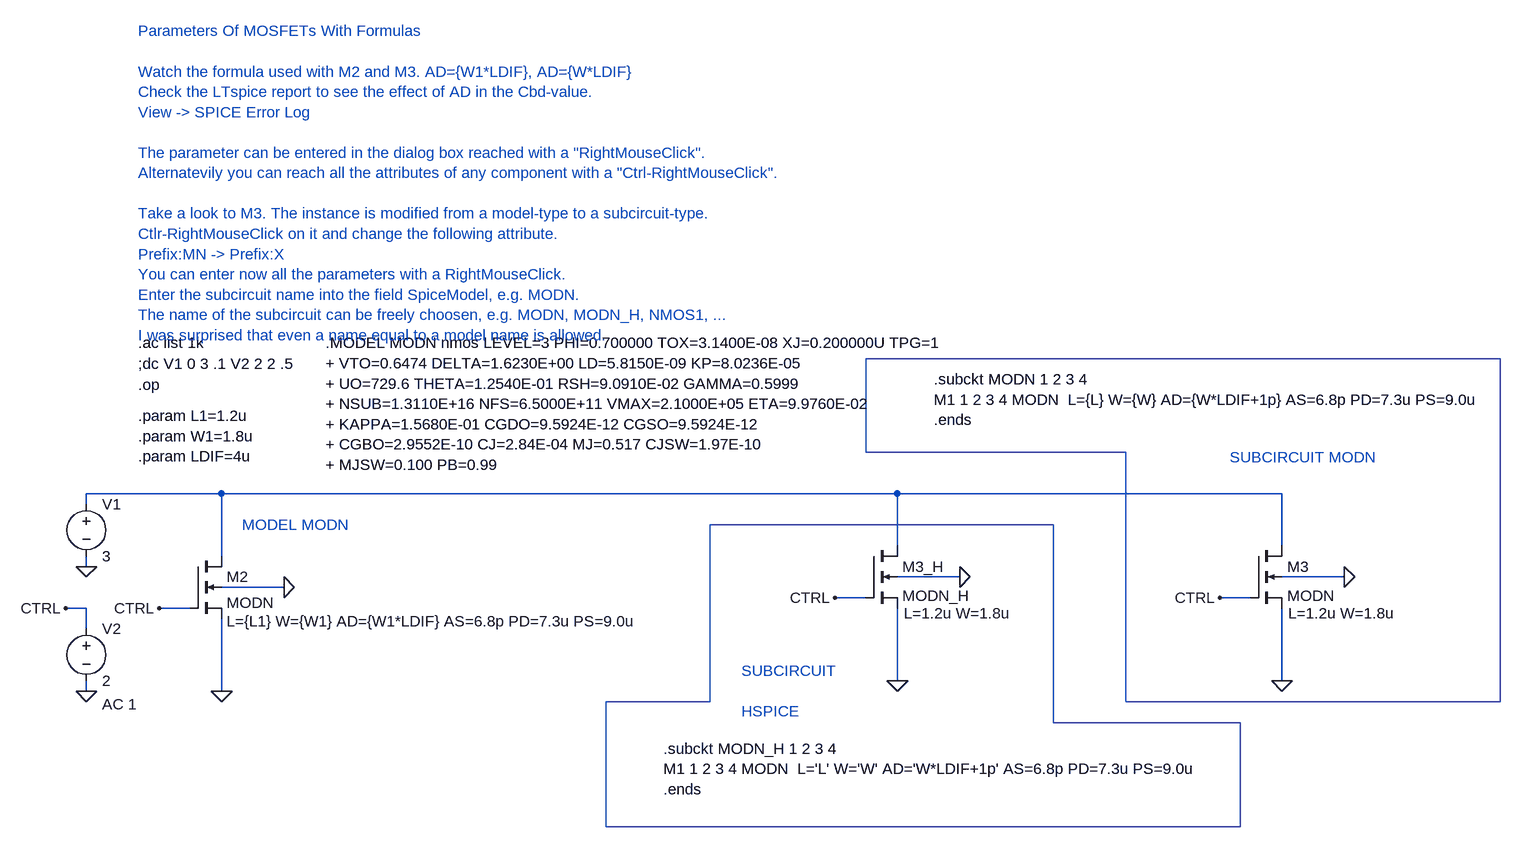
[diagram p0: schematic Mosfet_param_line_hspice.asc]
Mosfet_param_line_hspice.asc, the LTspice schematic file:
Version 4
SHEET 1 2056 680
WIRE -144 112 -352 112
WIRE 896 112 -144 112
WIRE 1488 112 896 112
WIRE -352 128 -352 112
WIRE 896 192 896 112
WIRE 1488 192 1488 112
WIRE -144 208 -144 112
WIRE -352 224 -352 208
WIRE 992 240 896 240
WIRE 1584 240 1488 240
WIRE -48 256 -144 256
WIRE 848 272 800 272
WIRE 1440 272 1392 272
WIRE -352 288 -384 288
WIRE -192 288 -240 288
WIRE -352 320 -352 288
WIRE 896 400 896 288
WIRE 1488 400 1488 288
WIRE -352 416 -352 400
WIRE -144 416 -144 304
FLAG -48 256 0
FLAG -144 416 0
FLAG -240 288 CTRL
FLAG 1584 240 0
FLAG 1488 400 0
FLAG 1392 272 CTRL
FLAG 992 240 0
FLAG 896 400 0
FLAG 800 272 CTRL
FLAG -352 224 0
FLAG -384 288 CTRL
FLAG -352 416 0
SYMBOL nmos4 -192 208 R0
WINDOW 123 56 100 Left 0
SYMATTR Value2 L={L1} W={W1} AD={W1*LDIF} AS=6.8p PD=7.3u PS=9.0u
SYMATTR InstName M2
SYMATTR Value MODN
SYMBOL nmos4 1440 192 R0
WINDOW 3 58 104 Left 0
WINDOW 38 56 77 Left 0
SYMATTR Value2 AS=6.8p PD=7.3u PS=9.0u
SYMATTR InstName M3
SYMATTR Value L=1.2u W=1.8u
SYMATTR Prefix X
SYMATTR SpiceModel MODN
SYMBOL nmos4 848 192 R0
WINDOW 3 58 104 Left 0
WINDOW 38 56 77 Left 0
SYMATTR Value2 AS=6.8p PD=7.3u PS=9.0u
SYMATTR InstName M3_H
SYMATTR Value L=1.2u W=1.8u
SYMATTR Prefix X
SYMATTR SpiceModel MODN_H
SYMBOL voltage -352 112 R0
WINDOW 123 0 0 Left 0
WINDOW 39 0 0 Left 0
SYMATTR InstName V1
SYMATTR Value 3
SYMBOL voltage -352 304 R0
WINDOW 123 24 132 Left 0
WINDOW 39 0 0 Left 0
SYMATTR Value2 AC 1
SYMATTR InstName V2
SYMATTR Value 2
TEXT -272 -56 Left 0 !.op
TEXT 16 -120 Left 0 !.MODEL MODN nmos LEVEL=3 PHI=0.700000 TOX=3.1400E-08 XJ=0.200000U TPG=1\n+ VTO=0.6474 DELTA=1.6230E+00 LD=5.8150E-09 KP=8.0236E-05\n+ UO=729.6 THETA=1.2540E-01 RSH=9.0910E-02 GAMMA=0.5999\n+ NSUB=1.3110E+16 NFS=6.5000E+11 VMAX=2.1000E+05 ETA=9.9760E-02\n+ KAPPA=1.5680E-01 CGDO=9.5924E-12 CGSO=9.5924E-12\n+ CGBO=2.9552E-10 CJ=2.84E-04 MJ=0.517 CJSW=1.97E-10\n+ MJSW=0.100 PB=0.99
TEXT -272 -88 Left 0 !;dc V1 0 3 .1 V2 2 2 .5
TEXT -272 -120 Left 0 !.ac list 1k
TEXT -272 -600 Left 0 ;Parameters Of MOSFETs With Formulas\n \nWatch the formula used with M2 and M3. AD={W1*LDIF}, AD={W*LDIF}\nCheck the LTspice report to see the effect of AD in the Cbd-value.\nView -> SPICE Error Log\n \nThe parameter can be entered in the dialog box reached with a "RightMouseClick".\nAlternatevily you can reach all the attributes of any component with a "Ctrl-RightMouseClick".\n \nTake a look to M3. The instance is modified from a model-type to a subcircuit-type.\nCtlr-RightMouseClick on it and change the following attribute.\nPrefix:MN -> Prefix:X\nYou can enter now all the parameters with a RightMouseClick.\nEnter the subcircuit name into the field SpiceModel, e.g. MODN.\nThe name of the subcircuit can be freely choosen, e.g. MODN, MODN_H, NMOS1, ...\nI was surprised that even a name equal to a model name is allowed.
TEXT -272 -8 Left 0 !.param L1=1.2u\n.param W1=1.8u\n.param LDIF=4u
TEXT 952 -64 Left 0 !.subckt MODN 1 2 3 4\nM1 1 2 3 4 MODN  L={L} W={W} AD={W*LDIF+1p} AS=6.8p PD=7.3u PS=9.0u\n.ends
TEXT 1408 56 Left 0 ;SUBCIRCUIT MODN
TEXT -112 160 Left 0 ;MODEL MODN
TEXT 536 504 Left 0 !.subckt MODN_H 1 2 3 4\nM1 1 2 3 4 MODN  L='L' W='W' AD='W*LDIF+1p' AS=6.8p PD=7.3u PS=9.0u\n.ends
TEXT 656 384 Left 0 ;SUBCIRCUIT\n \nHSPICE
LINE Normal 848 48 848 -96
LINE Normal 1248 48 848 48
LINE Normal 1248 368 1248 48
LINE Normal 1248 432 1248 368
LINE Normal 1824 432 1248 432
LINE Normal 1824 -96 1824 432
LINE Normal 848 -96 1824 -96
LINE Normal 1136 160 608 160
LINE Normal 1136 464 1136 160
LINE Normal 1424 464 1136 464
LINE Normal 1424 624 1424 464
LINE Normal 448 624 1424 624
LINE Normal 448 432 448 624
LINE Normal 608 432 448 432
LINE Normal 608 160 608 432

The netlist it stands for:
* Mosfet_param_line_hspice.asc
M2 N001 CTRL 0 0 MODN L={L1} W={W1} AD={W1*LDIF} AS=6.8p PD=7.3u PS=9.0u
XM3 N001 CTRL 0 0 MODN L=1.2u W=1.8u AS=6.8p PD=7.3u PS=9.0u  ; pins D G S B
XM3_H N001 CTRL 0 0 MODN_H L=1.2u W=1.8u AS=6.8p PD=7.3u PS=9.0u  ; pins D G S B
V1 N001 0 3
V2 CTRL 0 2 AC 1
.model NMOS NMOS
.model PMOS PMOS
.lib standard.mos
.op
.MODEL MODN nmos LEVEL=3 PHI=0.700000 TOX=3.1400E-08 XJ=0.200000U TPG=1
+ VTO=0.6474 DELTA=1.6230E+00 LD=5.8150E-09 KP=8.0236E-05
+ UO=729.6 THETA=1.2540E-01 RSH=9.0910E-02 GAMMA=0.5999
+ NSUB=1.3110E+16 NFS=6.5000E+11 VMAX=2.1000E+05 ETA=9.9760E-02
+ KAPPA=1.5680E-01 CGDO=9.5924E-12 CGSO=9.5924E-12
+ CGBO=2.9552E-10 CJ=2.84E-04 MJ=0.517 CJSW=1.97E-10
+ MJSW=0.100 PB=0.99
;dc V1 0 3 .1 V2 2 2 .5
.ac list 1k
* Parameters Of MOSFETs With Formulas
* Watch the formula used with M2 and M3. AD={W1*LDIF}, AD={W*LDIF}
* Check the LTspice report to see the effect of AD in the Cbd-value.
* View -> SPICE Error Log
* The parameter can be entered in the dialog box reached with a "RightMouseClick".
* Alternatevily you can reach all the attributes of any component with a "Ctrl-RightMouseClick".
* Take a look to M3. The instance is modified from a model-type to a subcircuit-type.
* Ctlr-RightMouseClick on it and change the following attribute.
* Prefix:MN -> Prefix:X
* You can enter now all the parameters with a RightMouseClick.
* Enter the subcircuit name into the field SpiceModel, e.g. MODN.
* The name of the subcircuit can be freely choosen, e.g. MODN, MODN_H, NMOS1, ...
* I was surprised that even a name equal to a model name is allowed.
.param L1=1.2u
.param W1=1.8u
.param LDIF=4u
.subckt MODN 1 2 3 4
M1 1 2 3 4 MODN  L={L} W={W} AD={W*LDIF+1p} AS=6.8p PD=7.3u PS=9.0u
.ends
* SUBCIRCUIT MODN
* MODEL MODN
.subckt MODN_H 1 2 3 4
M1 1 2 3 4 MODN  L='L' W='W' AD='W*LDIF+1p' AS=6.8p PD=7.3u PS=9.0u
.ends
* SUBCIRCUIT
* HSPICE
.backanno
.end